# Altium schematic sheet AutoReverse2.SchDoc
size A4
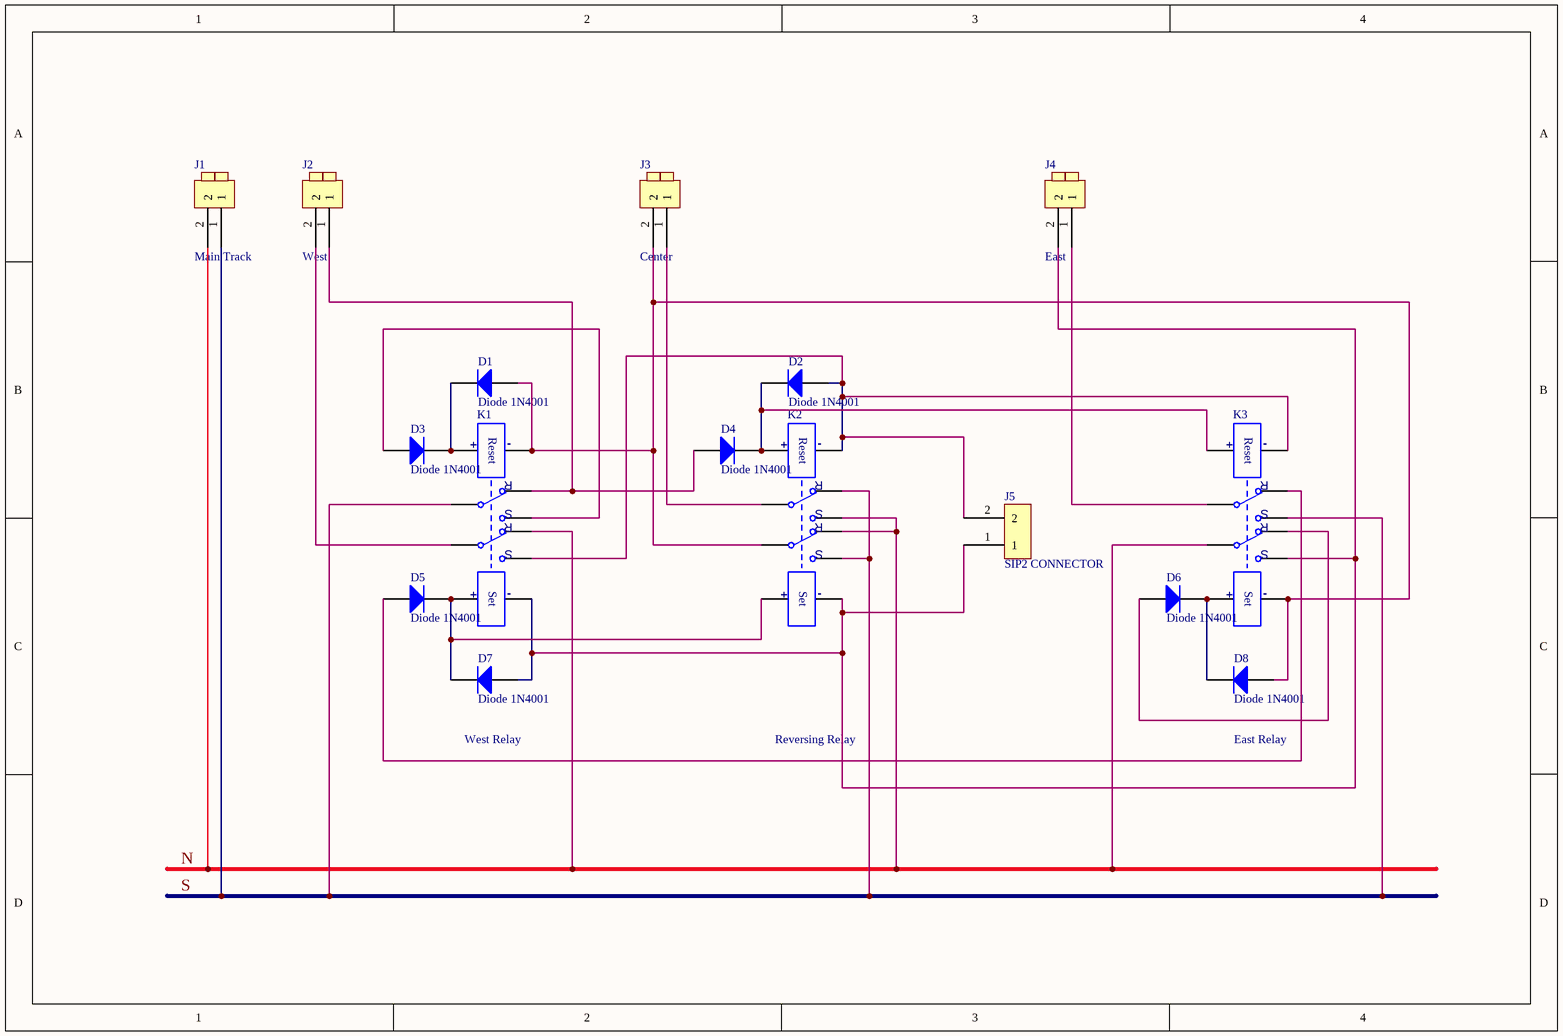
[diagram p0: AutoReverse2.SchDoc]

## Parts
D1  Diode 1N4001  [AXIAL-0.3]
D2  Diode 1N4001  [AXIAL-0.3]
D3  Diode 1N4001  [AXIAL-0.3]
D4  Diode 1N4001  [AXIAL-0.3]
D5  Diode 1N4001  [AXIAL-0.3]
D6  Diode 1N4001  [AXIAL-0.3]
D7  Diode 1N4001  [AXIAL-0.3]
D8  Diode 1N4001  [AXIAL-0.3]
J1  Main Track  [Screw Terminal 2 way 0.2]
J2  West  [Screw Terminal 2 way 0.2]
J3  Center  [Screw Terminal 2 way 0.2]
J4  East  [Screw Terminal 2 way 0.2]
J5  SIP2 CONNECTOR  [HDR1X2]
K1  West Relay  [DIP-10]
K2  Reversing Relay  [DIP-10]
K3  East Relay  [DIP-10]

## Nets
N: J1.2 K1.9(R) K2.4(S) K2.9(R) K3.8
S: J1.1 K1.3 K2.2(R) K2.7(S) K3.4(S)
NetD1_1: D1.1(A) D8.1(A) J3.2 K1.6 K2.8 K3.5
NetD1_2: D1.2(K) D3.2(K) K1.10
NetD2_1: D2.1(A) J5.2 K1.7(S) K2.6 K3.6
NetD2_2: D2.2(K) D4.2(K) K2.10 K3.10
NetD3_1: D3.1(A) K1.4(S)
NetD4_1: D4.1(A) J2.1 K1.2(R)
NetD5_1: D5.1(A) K3.2(R)
NetD5_2: D5.2(K) D7.2(K) K1.1 K2.1
NetD6_1: D6.1(A) K3.9(R)
NetD6_2: D6.2(K) D8.2(K) K3.1
NetD7_1: D7.1(A) J4.2 J5.1 K1.5 K2.5 K3.7(S)
NetJ2_2: J2.2 K1.8
NetJ3_1: J3.1 K2.3
NetJ4_1: J4.1 K3.3

## Notes on the sheet
- (in symbol EA2-5T Dual Coil 5V Latching Relay) Reset; -; +; Set

## Library data of the parts
D1-D8 = Diode 1N4001: 1 Amp General Purpose Rectifier; Revision 1: 11-Jul-2000: SIM Model Added.; Revision 2: 17-Jul-2002: Re-released for DXP Platform.; Package Information: Latest Revision: Aug-1999; Code - JEDEC: DO-204-AL; Published: 8-Jun-2000; Datasheet: Latest Revision: 1998; Package Reference: DO-41; Publisher: Altium Limited
J1-J4 = Screw Terminal 2 Way
K1-K3 = EA2-5T Dual Coil 5V Latching Relay: Published: 24-Mar-1999; Revision: July-2002: Re-released for DXP Platform.; Publisher: Altium Limited